# EAGLE design 主机 Microduino v0.1 (EAGLE 6.3)
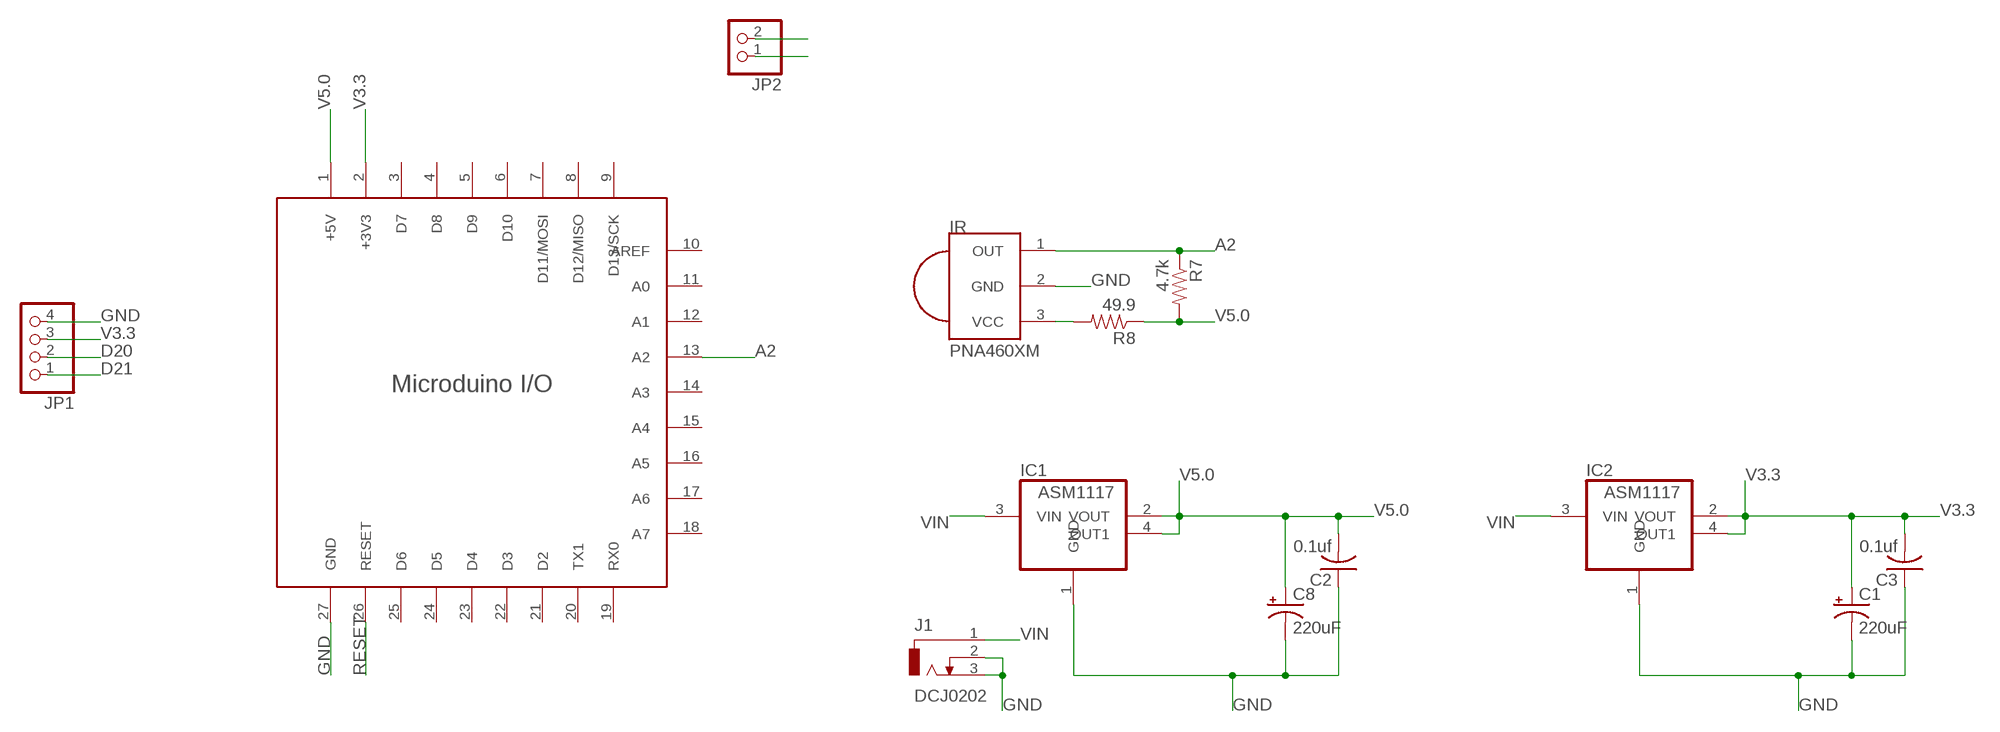
[diagram p0: schematic, sheet 1]

## Parts
C1  220uF  CPOL-USE2.5-5  [E2,5-5]
C2  0.1uf  C-US025-024X044  [C025-024X044]
C3  0.1uf  C-US025-024X044  [C025-024X044]
C8  220uF  CPOL-USE2.5-5  [E2,5-5]
IC1  ASM1117  [SOT223]
IC2  ASM1117  [SOT223]
IR  PNA460XM  [PNA460XM]
J1  DCJ0202  [DCJ0202]
JP1  PINHD-1X4  [1X04]
JP2  PINHD-1X2  [1X02]
R7  4.7k  RESISTORPTH1  [AXIAL-0.3]
R8  49.9  RESISTORPTH1  [AXIAL-0.3]
U$1  PING-MICRDUINO-DZ/1009  [PIN-MICRODUINO-1009]

## Nets
A2: IR.1(OUT) R7.P$1 U$1.13(A2)
D20: JP1.2 JP2.2
D21: JP1.1 JP2.1
GND [vcc]: C1.- C2.1 C3.1 C8.- IC1.1(GND) IC2.1(GND) IR.2(GND) J1.2 J1.3 JP1.4 U$1.27(GND)
N$3: IR.3(VCC) R8.P$2
RESET: U$1.26(RESET)
V3.3: C1.+ C3.2 IC2.2(VOUT) IC2.4(OUT1) JP1.3 U$1.2(+3V3)
V5.0: C2.2 C8.+ IC1.2(VOUT) IC1.4(OUT1) R7.P$2 R8.P$1 U$1.1(+5V)
VIN: IC1.3(VIN) IC2.3(VIN) J1.1
Unconnected: U$1.3(D7) U$1.4(D8) U$1.5(D9) U$1.6(D10) U$1.7(D11/MOSI) U$1.8(D12/MISO) U$1.9(D13/SCK) U$1.10(AREF) U$1.11(A0) U$1.12(A1) U$1.14(A3) U$1.15(A4) U$1.16(A5) U$1.17(A6) U$1.18(A7) U$1.19(RX0) U$1.20(TX1) U$1.21(D2) U$1.22(D3) U$1.23(D4) U$1.24(D5) U$1.25(D6)

## Library data of the parts
C1 C8 = resistor:CPOL-US: POLARIZED CAPACITOR, American symbol
C2 C3 = resistor:C-US: CAPACITOR, American symbol
IC1 IC2 = MY3:ASM1117: 800mA and 1A Low Dropout (LDO) Positive Regulator 1.8V, 2.5V, 2.85V, 3.3V, 5V, and Adj; MPN: REG1117; OC_FARNELL: 1097566; OC_NEWARK: 14P6981
IR = adafruit:PNA460XM: IR 38KHz receiver PNA4602 and related receivers http://www.ladyada.net/library/pcb/eaglelibrary.html
J1 = con-jack:DCJ0202: DC POWER JACK Source: DCJ0202.pdf; OC_FARNELL: unknown; OC_NEWARK: unknown
JP1 = pinhead:PINHD-1X4: PIN HEADER
JP2 = pinhead:PINHD-1X2: PIN HEADER
R7 R8 = MY:RESISTOR: Resistor Basic schematic elements and footprints for 0603, 1206, and PTH 1/10th watt (small) resistors.
U$1 = MY2:PING-MICRDUINO-DZ: microduino引脚封装

## Net classes
0 default: width 0.203 mm
1 vcc: width 0.254 mm

## Board
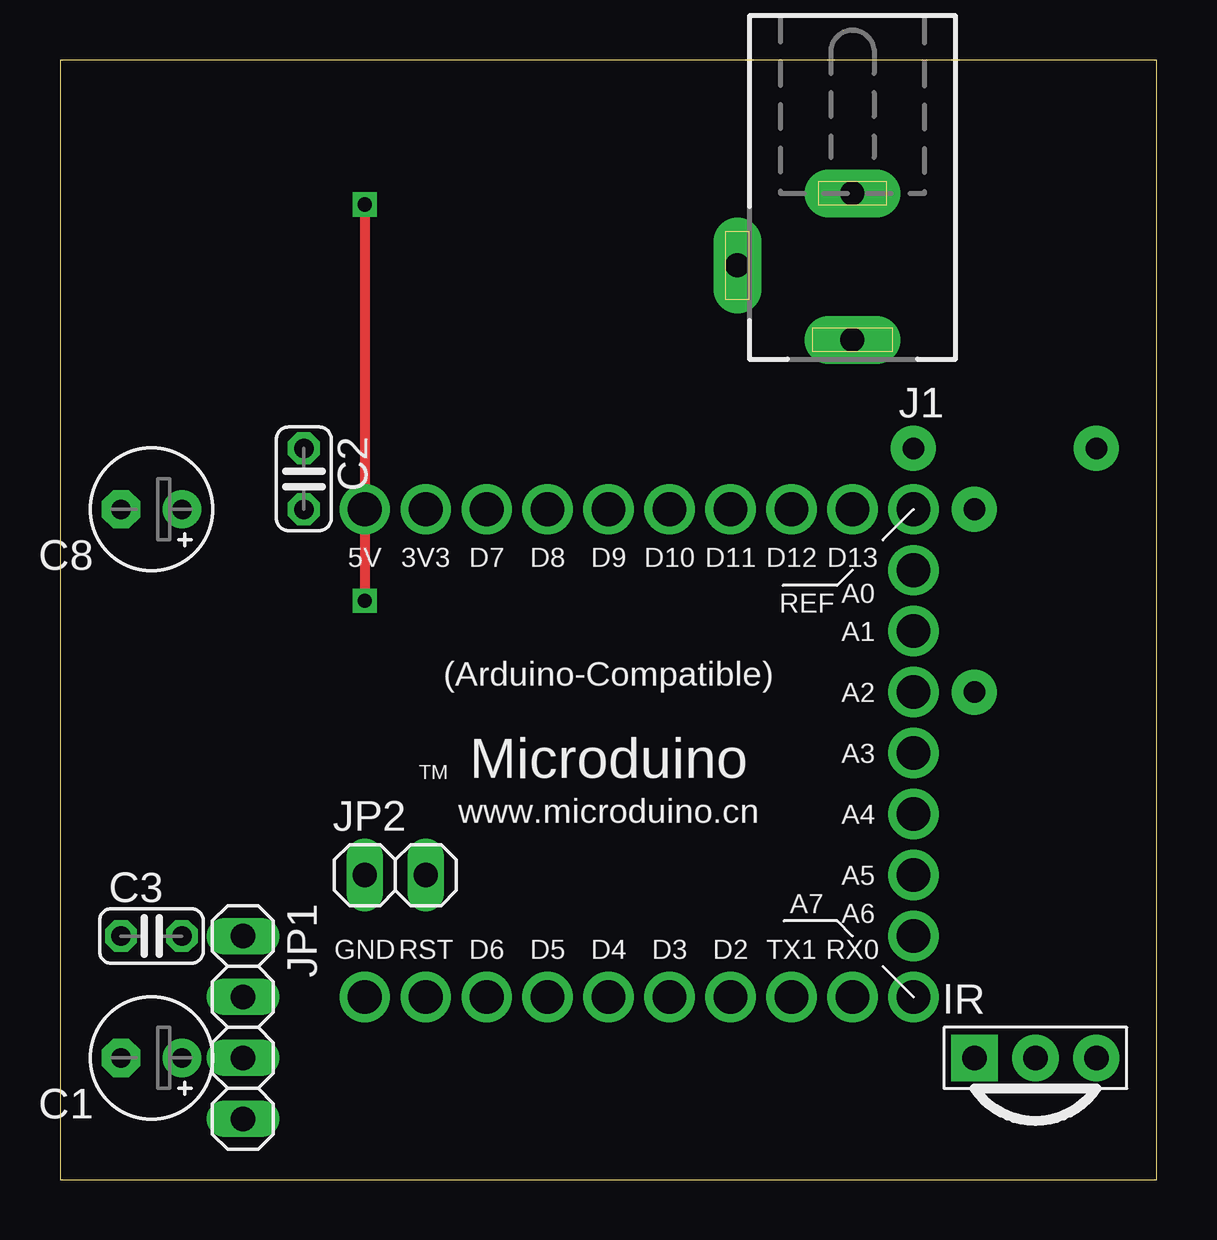
[diagram p1: board, top side]
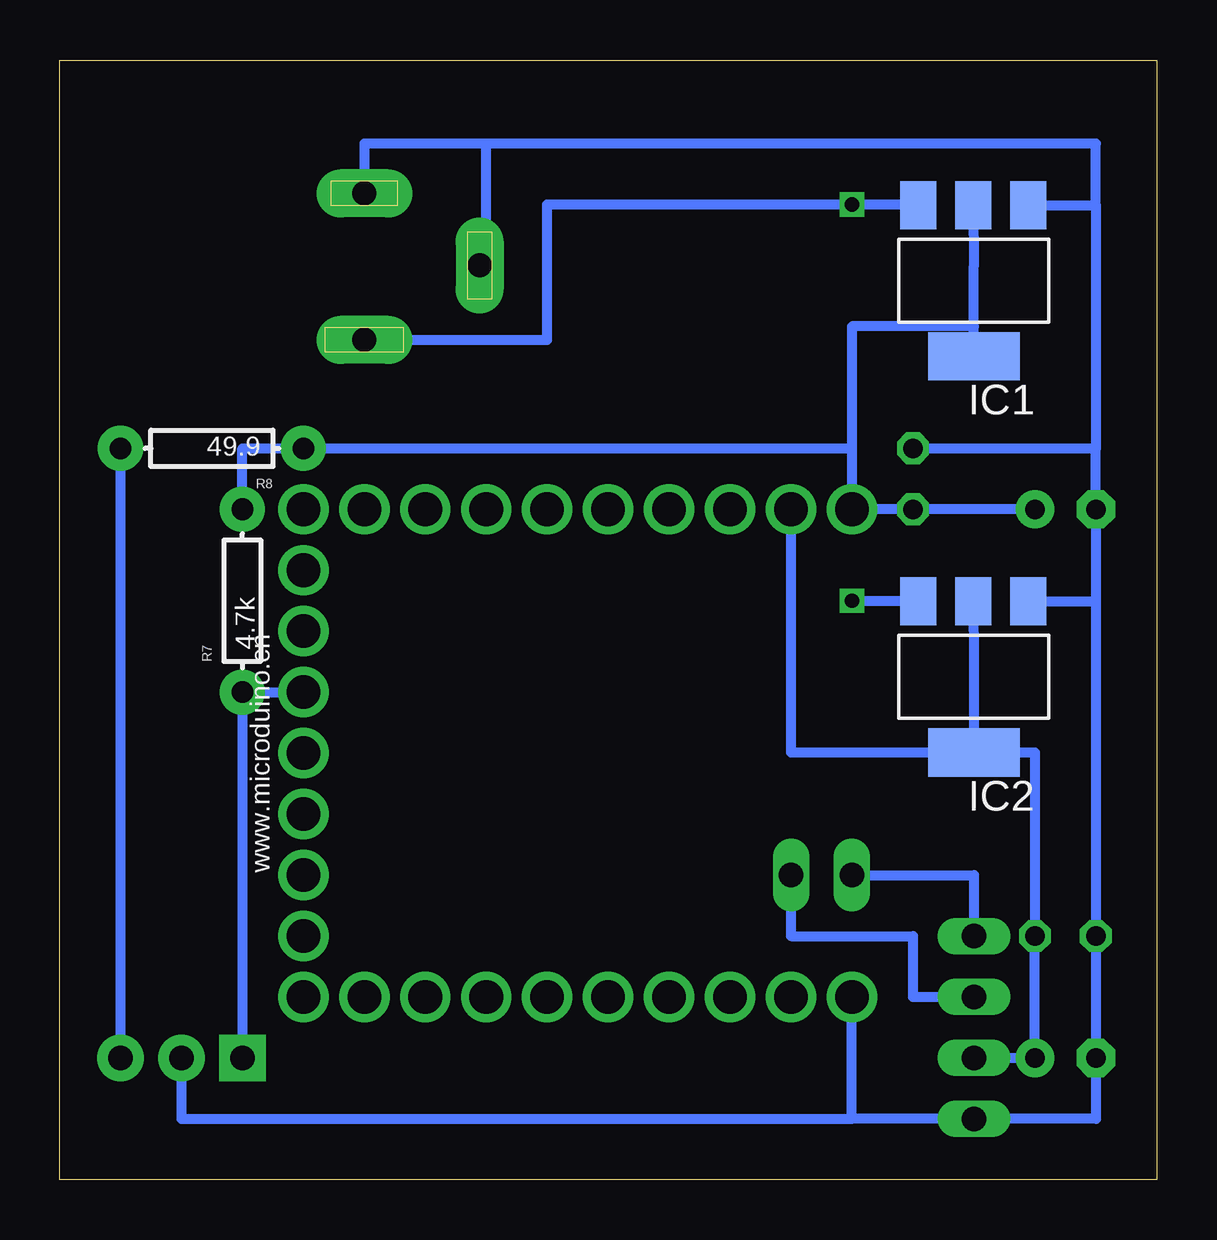
[diagram p2: board, bottom side, seen from below]

Size 45.7 x 46.66 mm. Coordinates in mm from the lower left corner, seen from the top.
Outline: 0,0 45.7,0 45.7,46.66 0,46.66 0,0
Copper layers (1*16): Top 0.035mm / dielectric 1.5mm / Bottom 0.035mm
Design rules "default": minimum track width 10mil, minimum drill 24mil, track to track 8mil, track to pad 8mil, pad to pad 8mil, via to via 8mil, smd to smd 8mil, copper to edge 40mil, drill to drill 8mil, minimum pad ring 10mil, minimum via ring 8mil, stop-mask expansion 4mil, vias tented up to drill 0mil, thermal gap 10mil

### Footprints (pad centres in the part's own frame; a part is rotated, then mirrored left to right if it is on the bottom)
E2,5-5 = drill 0.813 pad 1.6: + -1.27,0 | drill 0.813 pad 1.6 octagon: - 1.27,0
C025-024X044 = drill 0.813 octagon: 1 -1.27,0; 2 1.27,0
SOT223 = smd 1.499 x 2.007: 1 -2.261,-3.15; 2 0.025,-3.15; 3 2.311,-3.15 | smd 3.81 x 2.007: 4 0,3.15
PNA460XM = drill 1.016 pad 1.93 square: 1 -2.54,0 | drill 1.016 pad 1.93: 2 0,0; 3 2.54,0
DCJ0202 = drill 1 pad 2 long: 1 0,3.1; 2 4.8,0; 3 0,-3
1X04 = drill 1.016 long: 1 -3.81,0; 2 -1.27,0; 3 1.27,0; 4 3.81,0
1X02 = drill 1.016 long: 1 -1.27,0; 2 1.27,0
AXIAL-0.3 = drill 0.9 pad 1.88: P$1 -3.81,0; P$2 3.81,0
PIN-MICRODUINO-1009 = drill 1.4: 1 0,-10.16; 2 2.54,-10.16; 3 5.08,-10.16; 4 7.62,-10.16; 5 10.16,-10.16; 6 12.7,-10.16; 7 15.24,-10.16; 8 17.78,-10.16; 9 20.32,-10.16; 10 22.86,-10.16; 11 22.86,-7.62; 12 22.86,-5.08; 13 22.86,-2.54; 14 22.86,0; 15 22.86,2.54; 16 22.86,5.08; 17 22.86,7.62; 18 22.86,10.16; 19 20.32,10.16; 20 17.78,10.16; 21 15.24,10.16; 22 12.7,10.16; 23 10.16,10.16; 24 7.62,10.16; 25 5.08,10.16; 26 2.54,10.16; 27 0,10.16

### Placement (x,y rotation side)
C1  3.81,5.08 180 top
C2  10.16,29.21 270 top
C3  3.81,10.16 0 top
C8  3.81,27.94 180 top
IC1  7.62,37.47 180 bottom
IC2  7.62,20.95 180 bottom
IR  40.64,5.08 0 top
J1  33.02,38.1 180 top
JP1  7.62,6.35 270 top
JP2  13.97,12.7 0 top
R7  38.1,24.13 90 bottom
R8  39.37,30.48 180 bottom
U$1  12.7,17.78 180 bottom

### Tracks (layer width: path | path; a pad name or v marks a point on that pad's centre or on a via)
A2
  Bottom 0.406: IR.1 R7.P$1 U$1.13
D20
  Bottom 0.406: JP2.2 15.24,10.16 10.16,10.16 10.16,7.62 JP1.2
D21
  Bottom 0.406: JP2.1 7.62,12.7 JP1.1
GND
  Bottom 0.406: IR.2 40.64,2.54 12.7,2.54 | 12.7,2.54 U$1.27 | 12.7,2.54 JP1.4 2.54,2.54 C3.1 C1.- 2.54,24.11 | 2.54,40.61 2.54,30.48 | 2.54,24.11 C8.- 2.54,30.48 | IC1.1 2.54,40.61 | 2.54,40.61 2.54,43.18 27.94,43.18 | 27.94,43.18 33.02,43.18 J1.3 | IC2.1 2.54,24.11 | C2.1 2.54,30.48 | J1.2 27.94,38.1 27.94,43.18
N$3
  Bottom 0.406: R8.P$2 IR.3
V3.3
  Bottom 0.406: JP1.3 C1.+ C3.2 5.08,17.8 IC2.4 | U$1.2 15.24,17.8 IC2.4 | IC2.2 7.62,21.57 IC2.4
V5.0
  Bottom 0.406: 12.7,30.48 R8.P$1 38.1,30.48 R7.P$2 | 12.7,30.48 U$1.1 C2.2 C8.+ | IC1.2 7.62,38.08 7.62,35.56 | 7.62,35.56 12.7,35.56 12.7,30.48 | IC1.4 7.62,35.56
VIN  (via drill 0.6)
  Top 0.406: v12.7,40.64 v12.7,24.13
  Bottom 0.406: J1.1 25.4,35 25.4,40.64 v12.7,40.64 9.93,40.64 IC1.3 | IC2.3 12.7,24.11 v12.7,24.13